# EAGLE design mapleSDuino-V0.1_010-eagle7 (EAGLE 7.6.0)
MAPLE-CUx Large Version
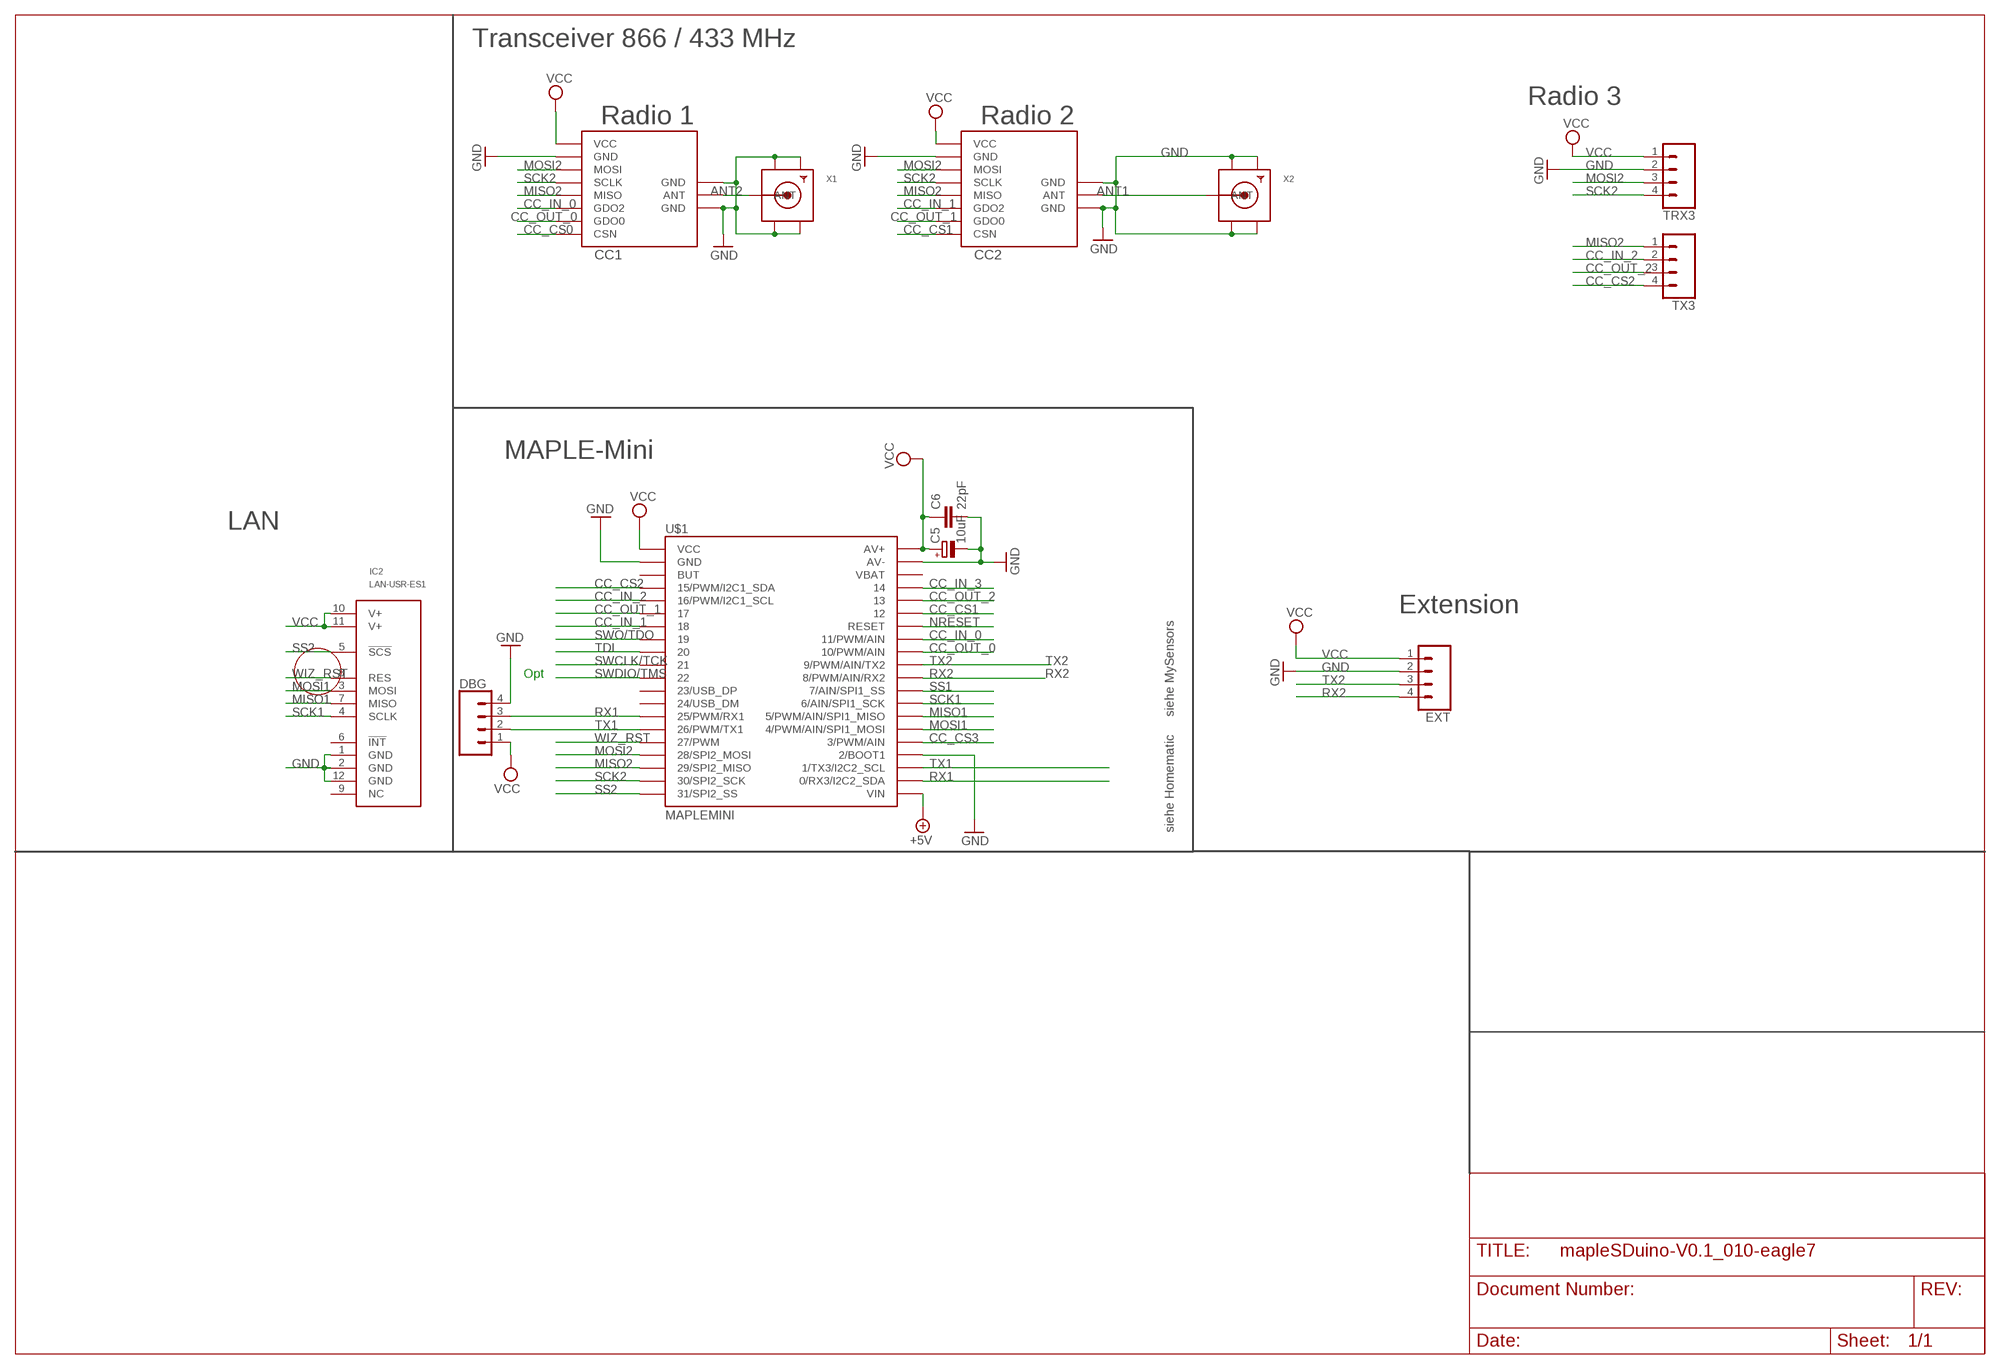
[diagram p0: schematic, sheet 1]

## Parts
C5  10uF  CPOL-EUR/2012-12W  [R/2012-12W]
C6  22pF  C-EUC0805  [C0805]
CC1  CC1101  CC1101_MODULE1SMD  [CC1101_MODULE1_SMD]
CC2  CC1101_MODULE1SMD  [CC1101_MODULE1_SMD]
DBG  CONN_04LOCK  [1X04_LOCK]
EXT  CONN_04PTH  [1X04]
IC2  LAN-USR-ES1  [USR-ES1]
TRX3  CONN_04PTH  [1X04]
TX3  CONN_04PTH  [1X04]
U$1  MAPLEMINI  [20-DIP]
X1  SMACONNECTOR_EDGE  [SMA_EDGELAUNCH]
X2  SMACONNECTOR_EDGE  [SMA_EDGELAUNCH]

## Nets
+5V [PWR]: U$1.21(VIN)
ANT1 [PWR]: CC2.ANT X2.P(ANT)
ANT2: CC1.ANT X1.P(ANT)
CC_CS0: CC1.CSN
CC_CS1: CC2.CSN U$1.35
CC_CS2: TX3.4 U$1.4(15/PWM/I2C1_SDA)
CC_CS3: U$1.25(3/PWM/AIN)
CC_IN_0: CC1.GDO2 U$1.33(11/PWM/AIN)
CC_IN_1: CC2.GDO2 U$1.7
CC_IN_2: TX3.2 U$1.5(16/PWM/I2C1_SCL)
CC_IN_3: U$1.37
CC_OUT_0: CC1.GDO0 U$1.32(10/PWM/AIN)
CC_OUT_1: CC2.GDO0 U$1.6
CC_OUT_2: TX3.3 U$1.36
GND [PWR]: C5.- C6.2 CC1.GND@0(GND) CC1.GND@1(GND) CC1.GND@2(GND) CC2.GND@0(GND) CC2.GND@1(GND) CC2.GND@2(GND) DBG.4 EXT.2 IC2.1(GND) IC2.2(GND) IC2.12(GND) TRX3.2 U$1.2(GND) U$1.24(2/BOOT1) U$1.39(AV-) X1.GND@1(GND4) X1.GND@2(GND3) X1.GND@3(GND2) X1.GND@4(GND1) X2.GND@1(GND4) X2.GND@2(GND3) X2.GND@3(GND2) X2.GND@4(GND1)
MISO1: IC2.7(MISO) U$1.27(5/PWM/AIN/SPI1_MISO)
MISO2: CC1.MISO CC2.MISO TX3.1 U$1.18(29/SPI2_MISO)
MOSI1: IC2.3(MOSI) U$1.26(4/PWM/AIN/SPI1_MOSI)
MOSI2: CC1.MOSI CC2.MOSI TRX3.3 U$1.17(28/SPI2_MOSI)
NRESET: U$1.34(RESET)
RX1: DBG.3 U$1.14(25/PWM/RX1) U$1.22(0/RX3/I2C2_SDA)
RX2: EXT.4 U$1.30(8/PWM/AIN/RX2)
SCK1: IC2.4(SCLK) U$1.28(6/AIN/SPI1_SCK)
SCK2: CC1.SCLK CC2.SCLK TRX3.4 U$1.19(30/SPI2_SCK)
SS1: U$1.29(7/AIN/SPI1_SS)
SS2: IC2.5(!SCS!) U$1.20(31/SPI2_SS)
SWCLK/TCK: U$1.10
SWDIO/TMS: U$1.11
SWO/TDO: U$1.8
TDI: U$1.9
TX1: DBG.2 U$1.15(26/PWM/TX1) U$1.23(1/TX3/I2C2_SCL)
TX2: EXT.3 U$1.31(9/PWM/AIN/TX2)
VCC [PWR]: C5.+ C6.1 CC1.VCC CC2.VCC DBG.1 EXT.1 IC2.10(V+) IC2.11(V+) TRX3.1 U$1.1(VCC) U$1.40(AV+)
WIZ_RST: IC2.8(RES) U$1.16(27/PWM)
Unconnected: IC2.6(!INT!) IC2.9(NC) U$1.3(BUT) U$1.12(23/USB_DP) U$1.13(24/USB_DM) U$1.38(VBAT)

## Notes on the sheet
- Transceiver 866 / 433 MHz
- Radio 3
- Radio 1 | Radio 2
- MAPLE-Mini
- LAN
- Extension
- Opt
- siehe MySensors
- siehe Homematic

## Library data of the parts
C5 = rcl:CPOL-EU: POLARIZED CAPACITOR, European symbol
C6 = rcl:C-EU: CAPACITOR, European symbol
CC1 CC2 = wireless:CC1101_MODULE1: CC1101 wireless module for 433/868 MHz (sold from Aliexpress). DIL version for mounting with pin header (and SMD soldering) and SMD only variant available.
DBG EXT TRX3 TX3 = SparkFun-Connectors:CONN_04: Multi connection point. Often used as Generic Header-pin footprint for 0.1 inch spaced/style header connections On any of the 0.1 inch spaced packages, you can populate with these: Break Away Headers - Straight <https://www.sparkfun.com/products/116> (PRT-00116) Break Away Male Headers - Right Angle <https://www.sparkfun.com/products/553> (PRT-00553) Female Headers <https://www.sparkfun.com/products/115> (PRT-00115) Break Away Headers - Machine Pin <https://www.sparkfun.com/products/117> (PRT-00117) Break Away Female Headers - Swiss Machine Pin <https://www.sparkfun.com/products/743> (PRT-00743) For SCREWTERMINALS and SPRING TERMINALS visit here: Screw Terimnals on SparkFun.com <https://www.sparkfun.com/search/results?term=Screw+Terminals> (5mm/3.5mm/2.54mm spacing) This device is also useful as a general connection point to wire up your design to another part of your project. Our various solder wires solder well into these plated through hole pads. Hook-Up Wire - Assortment (Stranded, 22 AWG) <https://www.sparkfun.com/products/11375> (PRT-11375) Hook-Up Wire - Assortment (Solid Core, 22 AWG) <https://www.sparkfun.com/products/11367> (PRT-11367) View the entire wire category on our website here <https://www.sparkfun.com/categories/141> Special notes: Molex polarized connector foot print use with SKU : PRT-08231 with associated crimp pins and housings. 1MM SMD Version SKU: PRT-10208; PROD_ID: CONN-09696
IC2 = Martin-Communication:LAN-USR-ES1
U$1 = maplemini-small:MAPLEMINI
X1 X2 = adafruit:SMACONNECTOR: SMA Connector 90° DIP SMA Connector, 50 Ohm (4UConnector: 07259)

## Net classes
0 default: width 0.305 mm
1 PWR: width 0.406 mm

## Board
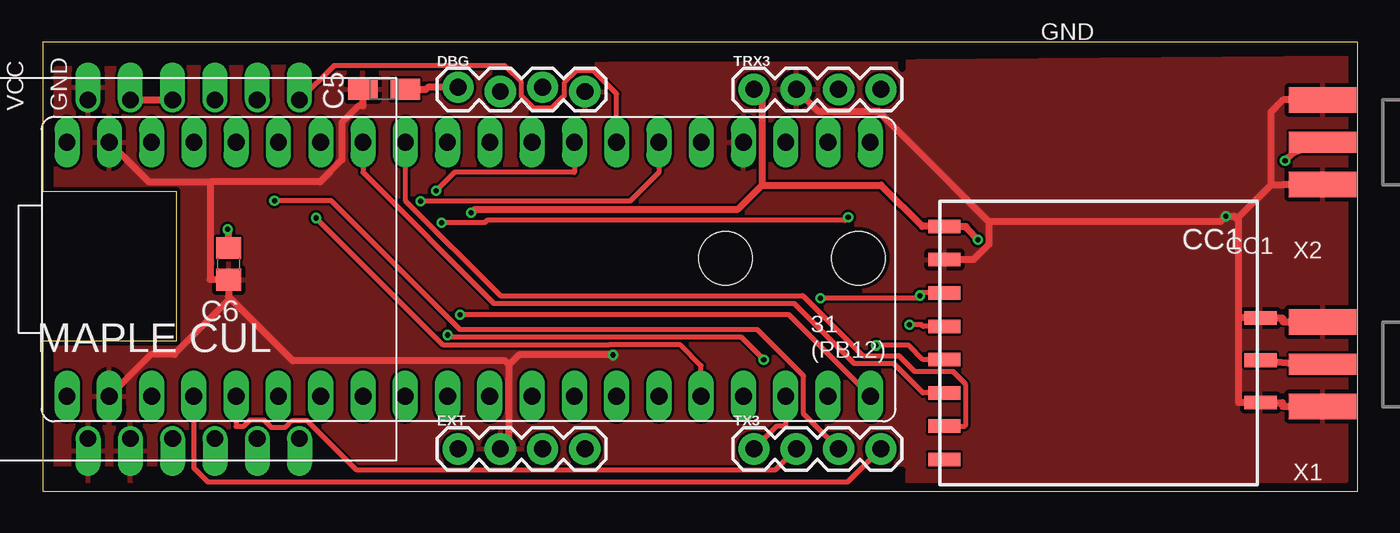
[diagram p1: board, top side]
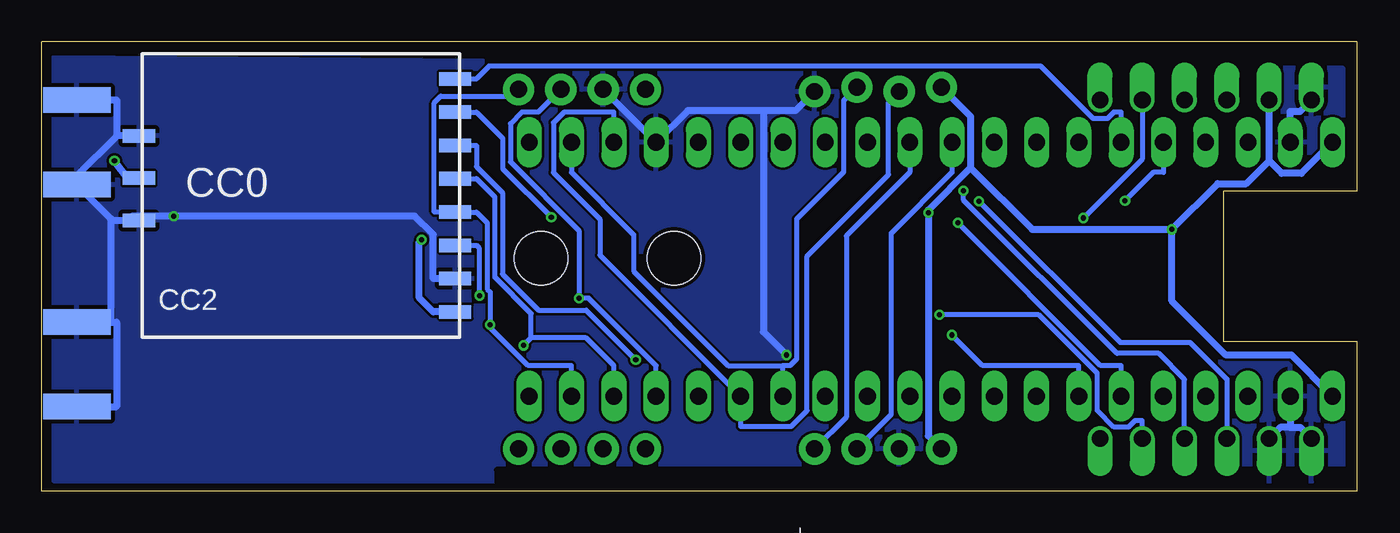
[diagram p2: board, bottom side, seen from below]

Size 79 x 27 mm. Coordinates in mm from the lower left corner, seen from the top.
Outline: 0,0 79,0 79,27 0,27 0,18 8,18 8,9 0,9 0,0
Copper layers (1*16): Top 0.035mm / dielectric 1.5mm / Bottom 0.035mm
Design rules "Fusion_eagle_rule_v1.1": minimum track width 6mil, minimum drill 12mil, track to track 6mil, track to pad 6mil, pad to pad 6mil, via to via 6mil, smd to smd 0mil, copper to edge 10mil, drill to drill 10mil, minimum pad ring 10mil, minimum via ring 6mil, stop-mask expansion 2mil, vias tented up to drill 100mil, thermal gap 10mil
Holes 3.2 mm at 49,14 41,14
tRestrict: 12 lines
bRestrict: 8 lines

### Footprints (pad centres in the part's own frame; a part is rotated, then mirrored left to right if it is on the bottom)
R/2012-12W = smd 1.75 x 1.26: + 1.275,0; - -1.275,0
C0805 = smd 1.3 x 1.5: 1 -0.95,0; 2 0.95,0
CC1101_MODULE1_SMD = smd 1.93 x 0.813: ANT 19,5.96; CSN 0,0; GDO0 0,2; GDO2 0,4; GND@0 0,12; GND@1 19,8.5; GND@2 19,3.42; MISO 0,6; MOSI 0,10; SCLK 0,8; VCC 0,14
1X04_LOCK = drill 1.016 pad 1.88: 1 0,0.127; 2 2.54,-0.127; 3 5.08,0.127; 4 7.62,-0.127
1X04 = drill 1.016 pad 1.88: 1 0,0; 2 2.54,0; 3 5.08,0; 4 7.62,0
USR-ES1 = drill 1 pad 1.35 offset: 1 -10.16,5.715; 2 -10.16,3.175; 3 -10.16,0.635; 4 -10.16,-1.905; 5 -10.16,-4.445; 6 -10.16,-6.985; 7 10.16,-6.985; 8 10.16,-4.445; 9 10.16,-1.905; 10 10.16,0.635; 11 10.16,3.175; 12 10.16,5.715
20-DIP = drill 1.016 pad 1.27 long: 1 -24.13,-7.62; 2 -21.59,-7.62; 3 -19.05,-7.62; 4 -16.51,-7.62; 5 -13.97,-7.62; 6 -11.43,-7.62; 7 -8.89,-7.62; 8 -6.35,-7.62; 9 -3.81,-7.62; 10 -1.27,-7.62; 11 1.27,-7.62; 12 3.81,-7.62; 13 6.35,-7.62; 14 8.89,-7.62; 15 11.43,-7.62; 16 13.97,-7.62; 17 16.51,-7.62; 18 19.05,-7.62; 19 21.59,-7.62; 20 24.13,-7.62 | drill 1 pad 1.27 long: 21 24.13,7.62; 22 21.59,7.62; 23 19.05,7.62; 24 16.51,7.62; 25 13.97,7.62; 26 11.43,7.62; 27 8.89,7.62; 28 6.35,7.62; 29 3.81,7.62; 30 1.27,7.62; 31 -1.27,7.62; 32 -3.81,7.62; 33 -6.35,7.62; 34 -8.89,7.62; 35 -11.43,7.62; 36 -13.97,7.62; 37 -16.51,7.62; 38 -19.05,7.62; 39 -21.59,7.62; 40 -24.13,7.62
SMA_EDGELAUNCH = smd 4.064 x 1.524: GND@1 2.032,-2.54; GND@2 2.032,2.54 | smd 4.064 x 1.524 bottom: GND@3 2.032,2.54; GND@4 2.032,-2.54 | smd 4.064 x 1.27: P 2.032,0

### Placement (x,y rotation side)
C5  20.5,24.13 0 top
C6  11.14,13.65 270 top
CC1  54.15,1.91 0 top
CC2  54.15,24.77 180 bottom
DBG  24.94,24.13 0 top
EXT  24.94,2.54 0 top
IC2  8.43,13.34 90 top
TRX3  42.72,24.13 0 top
TX3  42.72,2.54 0 top
U$1  25.57,13.34 0 top
X1  78.92,7.62 180 top
X2  78.92,20.95 180 top

### Tracks (layer width: path | path; a pad name or v marks a point on that pad's centre or on a via)
ANT1  (via drill 0.3 pad 0.61)
  Top 0.406: v74.62,19.85 75.13,20.32 X2.P
  Bottom 0.406: v74.62,19.85 74.6,19.83 73.84,18.8 CC2.ANT
ANT2
  Top 0.406: CC1.ANT 75.74,7.62 X1.P
CC_CS1
  Bottom 0.305: CC2.CSN 52.88,24.77 52.12,25.52 18.97,25.52 15.83,22.38 14.97,22.38 14.58,22.77 14.14,22.77 U$1.35
CC_CS2
  Top 0.305: U$1.4 9.06,1.41 9.91,0.56 48.36,0.56 TX3.4
CC_IN_0
  Top 0.305: CC1.GDO2 52.88,5.91 51.11,7.68 48.73,7.68 45.13,11.28 27.09,11.28 19.23,19.14 U$1.33
CC_IN_1  (via drill 0.3 pad 0.61)
  Top 0.305: v43.3,7.9 41.95,9.25 24.44,9.25 v24.3,9.38
  Bottom 0.305: v24.3,9.38 22.47,7.54 16.68,7.54 U$1.7 | v43.3,7.9 46.28,10.88 49.15,10.88 51.31,13.04 51.31,17.93 52.88,19.5 52.88,20.77 CC2.GDO2
CC_IN_2
  Top 0.305: U$1.5 11.61,3.89 12.05,3.89 12.44,4.28 13.27,4.28 13.7,3.85 14.57,3.85 14.98,4.26 15.85,4.26 18.82,1.29 44.01,1.29 TX3.2
CC_OUT_0
  Top 0.305: CC1.GDO0 55.42,3.9 55.42,6.45 54.67,7.19 52.36,7.19 51.42,8.14 49.25,8.14 45.65,11.74 27.48,11.74 21.77,17.45 U$1.32
CC_OUT_1  (via drill 0.3 pad 0.61)
  Top 0.305: v48.38,16.44 48.19,16.26 26.67,16.26 26.54,16.12 v23.96,16.12
  Bottom 0.305: v23.96,16.12 15.38,7.54 14.14,7.54 U$1.6 | CC2.GDO0 52.88,22.77 51.3,21.18 51.3,19.36 v48.38,16.44
CC_OUT_2  (via drill 0.3 pad 0.61)
  Top 0.305: TX3.3 45.69,4.65 45.69,6.93 42.92,9.71 25.05,9.71 17.31,17.45 v13.91,17.45
  Bottom 0.305: U$1.36 11.61,19.14 12.22,19.14 v13.91,17.45
GND  (via drill 0.3 pad 0.61)
  Top 0.406: 28.01,7.59 27.77,7.83 15.01,7.83 11.25,11.59 | EXT.2 28.01,3.07 28.01,7.59 | v34.25,8.18 28.59,8.18 28.01,7.59 | 10.04,18.58 16.64,18.58 17.95,19.9 17.95,22.13 18.97,23.14 19.22,23.14 C5.- | 11.25,11.59 11.14,11.69 C6.2 10.04,12.7 10.04,18.58 | 11.25,11.59 7.89,8.22 6.49,8.22 U$1.2 | 56.84,16.18 56.84,14.83 55.91,13.9 CC1.GND@0 | TRX3.2 46.56,22.83 50.2,22.83 56.84,16.18 | 56.84,16.18 70.74,16.18 v71.07,16.52 71.57,16.52 71.73,16.36 | 71.73,16.36 71.83,16.26 71.83,10.4 | 71.73,16.36 73.78,18.41 | 73.78,18.41 74.5,18.41 X2.GND@2 | 73.78,18.41 73.78,22.78 74.5,23.5 X2.GND@1 | 71.83,10.4 71.83,5.33 CC1.GND@2 74.47,5.33 74.47,5.1 74.5,5.08 X1.GND@2 | U$1.39 6.36,18.58 10.04,18.58 | 71.83,10.4 CC1.GND@1 74.47,10.4 74.5,10.38 74.5,10.16 X1.GND@1
  Bottom 0.406: 35.64,22.86 40.18,22.86 U$1.24 TRX3.2 | DBG.4 33.7,22.86 35.64,22.86 | 35.64,22.86 35.64,9.57 v34.25,8.18 | 74.47,21.34 76.88,18.93 X2.GND@2 74.84,16.37 74.84,16.27 | 74.47,21.34 74.5,21.37 74.5,23.5 X2.GND@1 | CC2.GND@2 74.47,21.34 | 74.84,16.27 74.84,10.16 | 74.84,16.27 73.81,16.27 | 74.84,10.16 74.5,10.16 74.5,5.08 X1.GND@2 | X1.GND@1 74.84,10.16 | 73.81,16.27 73.55,16.52 v71.07,16.52 56.58,16.52 55.47,15.42 55.47,12.77 CC2.GND@0 | CC2.GND@1 73.81,16.27 | 3.99,3.83 3.38,3.83 IC2.1 | 3.99,3.83 3.99,3.98 U$1.2 | 3.99,3.83 4.59,3.83 IC2.2 | U$1.39 3.99,22.82 3.39,22.82 IC2.12
  pour Top: 0.81,25.4 78.28,26.04 78.28,0.64 0.81,0.64
  pour Bottom: 0.81,25.4 78.28,26.04 78.28,0.64 0.81,0.64
MISO1
  Top 0.305: U$1.27 34.47,23.86 33.08,25.25 32.04,25.25 31.31,24.52 31.31,23.75 30.57,23 29.46,23 28.75,23.71 28.75,24.55 27.74,25.56 17.48,25.56 IC2.7
MISO2  (via drill 0.3 pad 0.61)
  Top 0.305: v50.05,8.76 52.03,8.76 52.88,7.91 CC1.MISO | U$1.18 44.62,3.89 44.07,3.89 TX3.1
  Bottom 0.305: 49.59,9.21 v50.05,8.76 | 49.59,9.21 46.29,9.21 44.62,7.54 U$1.18 | 49.59,9.21 49.59,10.67 51.77,12.85 51.77,17.66 52.88,18.77 CC2.MISO
MOSI1  (via drill 0.3 pad 0.61)
  Top 0.305: U$1.26 37.01,19.14 35.28,17.42 v22.69,17.42
  Bottom 0.305: v22.69,17.42 14.2,8.94 10.01,8.94 7.79,6.72 IC2.3
MOSI2  (via drill 0.3 pad 0.61)
  Top 0.305: v46.72,11.59 52.54,11.59 v52.7,11.75 52.72,11.75 52.88,11.9 CC1.MOSI
  Bottom 0.305: CC2.MOSI 52.88,14.77 52.7,14.58 v52.7,11.75 | TRX3.3 49.16,22.77 50.15,22.77 50.84,22.08 50.84,19.77 46.72,15.65 v46.72,11.59 46.13,11.59 42.09,7.54 U$1.17
RX1
  Bottom 0.305: DBG.3 30.81,23.46 30.81,19.17 33.64,16.34 33.64,7.93 34.03,7.54 34.47,7.54 | 34.47,7.54 37.76,7.54 43.43,13.21 43.43,15.4 47.16,19.14 U$1.22 | U$1.14 34.47,7.54
RX2
  Bottom 0.305: EXT.4 30.66,4.45 30.66,15.33 26.84,19.14 U$1.30
SCK1  (via drill 0.3 pad 0.61)
  Top 0.305: v23.61,18.04 24.72,19.14 31.92,19.14 U$1.28
  Bottom 0.305: IC2.4 10.34,6.72 11.89,8.27 14.4,8.27 23.61,17.48 v23.61,18.04
SCK2  (via drill 0.3 pad 0.61)
  Top 0.305: v52.06,10 52.78,10 52.88,9.9 CC1.SCLK
  Bottom 0.305: U$1.19 47.16,7.54 49.77,7.54 52.06,9.83 v52.06,10 52.06,11.97 52.23,12.14 52.23,16.11 52.88,16.77 CC2.SCLK 55.42,16.77 55.42,23.32 55.02,23.72 50.75,23.72 TRX3.4
SS2  (via drill 0.3 pad 0.61)
  Top 0.305: U$1.20 44.82,10.6 v25.06,10.6
  Bottom 0.305: v25.06,10.6 19.09,10.6 15.58,7.08 15.58,4.86 14.57,3.85 13.7,3.85 13.31,4.23 12.88,4.23 IC2.5
TX1
  Bottom 0.305: U$1.23 44.62,22.77 47.61,22.77 48.25,22.13 48.25,19.13 45.46,16.34 45.46,14.17 U$1.15 37.01,3.89 33.96,3.89 33.01,4.84 33.01,14.12 28.11,19.02 28.11,23.37 DBG.2
TX2
  Bottom 0.305: EXT.3 27.95,4.61 27.95,15.49 24.3,19.14 U$1.31
VCC  (via drill 0.3 pad 0.61)
  Top 0.406: 43.2,18.38 41.73,16.91 25.91,16.91 v25.73,16.73 | TRX3.1 43.2,23.65 43.2,18.38 | 43.2,18.38 50.35,18.38 52.83,15.9 CC1.VCC 55.47,15.9 55.47,15.81 v56.18,15.11 | C6.1 11.14,15.67 v11.09,15.72 | C5.+ 23,24.13 23.13,24.26 DBG.1 | IC2.11 IC2.10
  Bottom 0.406: EXT.1 25.73,3.33 v25.73,16.73 25.73,16.88 23.19,19.42 | 23.19,19.42 19.49,15.72 v11.09,15.72 | DBG.1 23.19,22.5 23.19,19.42 | U$1.1 3.9,8.17 7.85,8.17 11.09,11.42 v11.09,15.72 | 5.26,19.84 IC2.11 | U$1.40 3.32,19.09 4.5,19.09 5.26,19.84 | v11.09,15.72 8.35,18.47 6.63,18.47 5.26,19.84 | CC2.VCC 55.47,10.77 56.31,11.61 56.31,14.97 v56.18,15.11
WIZ_RST  (via drill 0.3 pad 0.61)
  Top 0.305: v16.41,16.41 24.05,8.77 33.98,8.77 34,8.79 38.3,8.79 39.55,7.54 U$1.16
  Bottom 0.305: IC2.8 12.88,19.94 v16.41,16.41

### Text on the board
tNames: GND | TX | RX | GND | VCC | GND | CC1 | 31 / (PB12) | MAPLE CUL
bNames: MAPLE CUL | Small V2.0 / www.neuby.de | CC0 | + | TX | RX | GND